# EAGLE design PICKIT4-adaptorar (EAGLE 7.7.0)
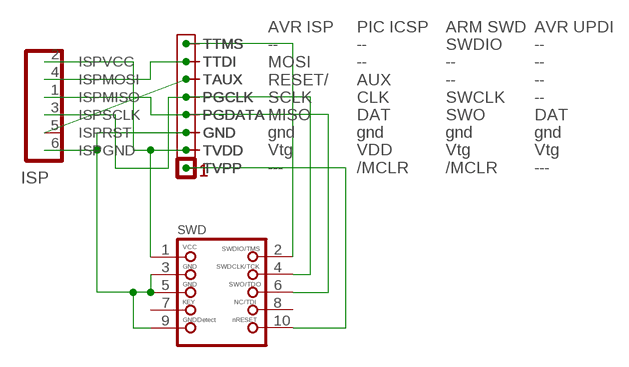
[diagram p0: schematic, sheet 1]

## Parts
ISP  AVR-ISP  [6PINS]
SWD  JTAG-CORTEXM3  [2X05_1.27MM_SMT]
U$1  PICKIT4PINHDR  [PINHEAD1X8]
U$3  PICKIT4PINHDR  [PINHEAD1X8]
U$4  PICKIT4PINHDR  [PINHEAD1X8]

## Nets
CLK [clock]: ISP.3(ISPSCLK) SWD.4 U$1.P$5(PGCLK) U$3.P$5(PGCLK) U$4.P$5(PGCLK)
DATA [clock]: ISP.1(ISPMISO) SWD.6 U$1.P$4(PGDATA) U$3.P$4(PGDATA) U$4.P$4(PGDATA)
GND [power]: ISP.6(ISPGND) SWD.3 SWD.5 SWD.9 U$1.P$3(GND) U$3.P$3(GND) U$4.P$3(GND)
TAUX: ISP.5(ISPRST) U$1.P$6(TAUX) U$3.P$6(TAUX) U$4.P$6(TAUX)
TTDI [clock]: ISP.4(ISPMOSI) U$1.P$7(TTDI) U$3.P$7(TTDI) U$4.P$7(TTDI)
TTMS: SWD.2 U$1.P$8(TTMS) U$3.P$8(TTMS) U$4.P$8(TTMS)
TVDD [power]: ISP.2(ISPVCC) SWD.1 U$1.P$2(TVDD) U$3.P$2(TVDD) U$4.P$2(TVDD)
VPP: SWD.10 U$1.P$1(TVPP) U$3.P$1(TVPP) U$4.P$1(TVPP)
Unconnected: SWD.7 SWD.8

## Library data of the parts
ISP = Arduino-shield-scaffolds:AVR-ISP: AVR SPI ISP programming connector (6pins)
SWD = microbuilder:JTAG-CORTEXM3: Serial Wire (SW-DP) Connector This standard 0.05" 10-pin connector is for use with the Cortex M0/M3's native SWD (serial wire debugger) interface (SW-DP). Some boards support a 20-pin combined JTAG+SWD connector (SWJ-DP), such as the LPC1700 family, but many smaller devices only work with SWD which typically use the smaller 10-pin SW-DP connecter (the LPC1300 family, for example, only supports SWD). 2x05 1.27mm/0.05" Connector: This is the standard SMT connector defined by ARM for all Cortex devices, and should be used in most situations and for forward-compatibility since any new devices coming to market will likely use this connector. MOLEX 10 Pin 0.1" Connector: This 0.1" 10 pin connector has the same pin layout as the standard 0.05" connector, but is easier to work with if you are using standard jumper wires or custom cables to connect your SWD hardware. MOLEX 20 Pin 0.1" Connector: This 0.1" 20 pin connector is the same model used for ARM7/ARM9 JTAG debuggers, but is connected to match the pins on the Segger J-Link for ARM (which supports both JTAG and SWD debugging). See the following document from ARM for more information on Cortex M3 Debug Connectors: http://infocenter.arm.com/help/topic/com.arm.doc.faqs/attached/13634/cortex_debug_connectors.pdf And the following page for an overview with images of the different connector types: http://www.keil.com/peripherals/coresight/connectors.asp
U$1 U$3 U$4 = mylib4:PICKIT4: PICKIT 4 Programming connector Handles PICx, ARM SWD, AVR ISP, UPDI, PDI, TPI, an JTAG/EJTAG

## Net classes
0 default: width 0.4 mm, drill 0.6 mm, clearance 0.152 mm
1 power: width 0.8 mm, drill 0.7 mm, clearance 0.152 mm
2 clock: width 0.25 mm, drill 0.6 mm, clearance 0.152 mm

## Board
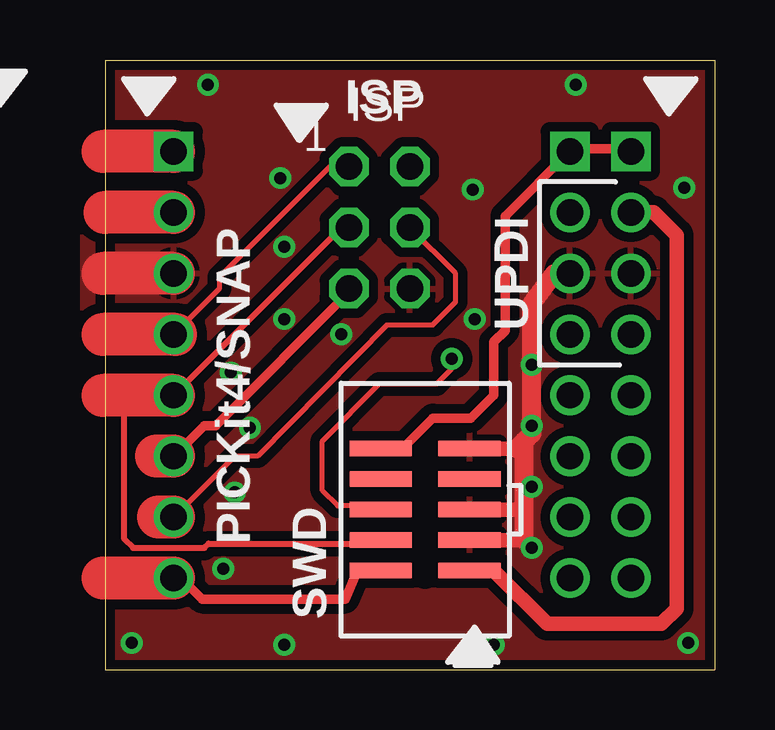
[diagram p1: board, top side]
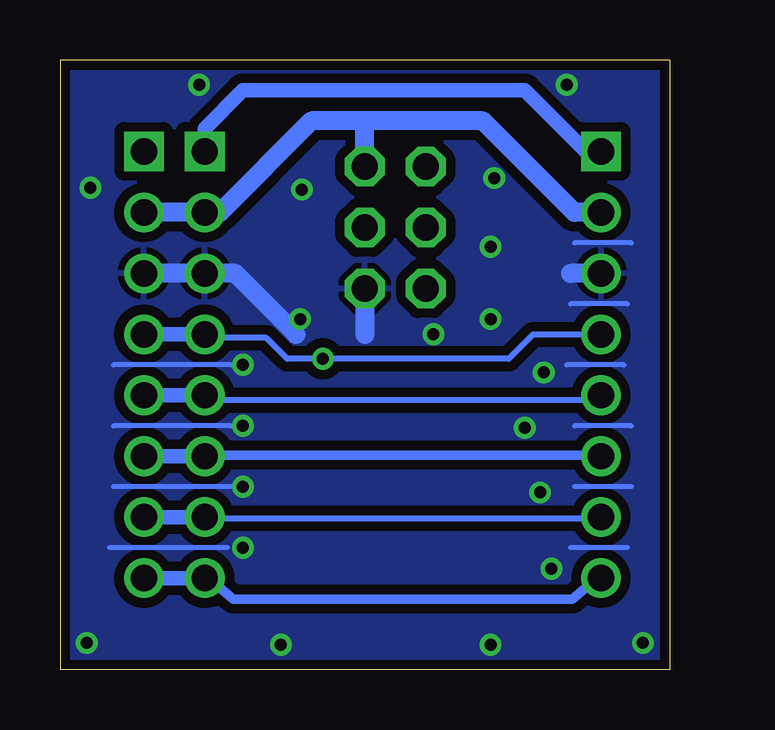
[diagram p2: board, bottom side, seen from below]

Size 25.4 x 25.4 mm. Coordinates in mm from the lower left corner, seen from the top.
Outline: 0,0 25.4,0 25.4,25.4 0,25.4 0,0
Copper layers (1*16): Top 0.035mm / dielectric 1.5mm / Bottom 0.035mm
Design rules "default *": minimum track width 10mil, minimum drill 24mil, track to track 6mil, track to pad 6mil, pad to pad 8mil, via to via 8mil, smd to smd 8mil, copper to edge 16mil, drill to drill 8mil, minimum pad ring 10mil, minimum via ring 8mil, stop-mask expansion 4mil, vias tented up to drill 0.65mm, thermal gap 10mil
tRestrict: 2 lines

### Footprints (pad centres in the part's own frame; a part is rotated, then mirrored left to right if it is on the bottom)
6PINS = drill 1.1 octagon: 1 -1.27,2.54; 2 1.27,2.54; 3 -1.27,0; 4 1.27,0; 5 -1.27,-2.54; 6 1.27,-2.54
2X05_1.27MM_SMT = smd 0.65 x 2.6: 1 -2.54,-1.85; 2 -2.54,1.85; 3 -1.27,-1.85; 4 -1.27,1.85; 5 0,-1.85; 6 0,1.85; 7 1.27,-1.85; 8 1.27,1.85; 9 2.54,-1.85; 10 2.54,1.85
PINHEAD1X8 = drill 1.1 square: P$1 0,8.89 | drill 1.1: P$2 0,6.35; P$3 0,3.81; P$4 0,1.27; P$5 0,-1.27; P$6 0,-3.81; P$7 0,-6.35; P$8 0,-8.89

### Placement (x,y rotation side)
ISP  11.43,18.41 0 top
SWD  13.34,6.67 90 top
U$1  2.86,12.7 0 top
U$3  21.91,12.7 0 top
U$4  19.37,12.7 0 top

### Tracks (layer width: path | path; a pad name or v marks a point on that pad's centre or on a via)
CLK
  Top 0.254: SWD.4 11.38,5.25 4.31,5.25 4.13,5.08 1.16,5.08 0.78,5.46 0.78,11.34 2.8,11.38 U$1.P$5 2.98,11.55 9.8,18.38 10.15,18.38 ISP.3
  Top 1.8: U$1.P$5 -0.08,11.43
  Bottom 0.254: U$4.P$5 19.25,11.22 2.98,11.22 U$1.P$5
  Bottom 0.6: U$4.P$5 U$3.P$5
DATA  (via drill 0.5)
  Top 0.2: ISP.1 9.37,20.95 4.76,16.35 4.76,15.88 2.94,14.05 U$1.P$4 | 10.32,6.83 9.68,6.83 9.05,7.46 9.05,9.53 11.43,11.91 13.81,11.91 14.45,12.54 v14.45,12.95
  Top 0.254: 10.32,6.83 11.38,6.83 SWD.6
  Top 1.5: 2.94,14.05 2.94,13.97
  Top 1.8: 2.94,13.97 -0.08,13.97
  Bottom 0.25: 6.71,12.95 5.69,13.97 U$1.P$4
  Bottom 0.254: 6.71,12.95 v14.45,12.95 15.93,12.95 16.8,13.82 19.25,13.82 U$4.P$4
  Bottom 0.6: U$4.P$4 U$3.P$4
GND  (via drill 0.5)
  Top 0.6: SWD.3 17.46,5.4 | SWD.9 17.14,9.21 | SWD.5 17.46,6.67
  Top 0.8: 17.46,5.4 17.46,6.67 17.46,9.53 | 17.46,9.53 17.78,9.84 17.78,15.24 18.73,16.51 U$4.P$3 | 17.14,9.21 17.46,9.53
  Top 1.8: U$1.P$3 -0.08,16.51
  Bottom 0.2: 1.59,7.62 3.97,7.62 | 1.59,10.16 3.97,10.16 | 1.91,12.7 4.29,12.7 | 1.75,5.08 4.13,5.08 | 1.75,15.24 4.13,15.24 | 1.59,17.78 3.97,17.78 | 18.26,7.62 23.18,7.62 | 18.26,10.16 23.18,10.16 | 18.26,12.7 23.18,12.7 | 18.41,5.08 23.34,5.08
  Bottom 0.8: U$1.P$3 4.13,16.51 | 15.56,13.97 18.1,16.51 U$4.P$3 U$3.P$3 | ISP.6 12.7,13.97
  other vias: 17.78,12.7 17.78,10.16 17.78,7.62 17.78,5.08 5.4,7.38 7.46,1.03 16.19,1.03 7.3,20.48 24.13,20.08 6.03,10.08 9.84,13.97 7.46,14.61 15.4,14.61 7.46,17.62 5.24,12.38 4.29,24.37 19.61,24.37 1.11,1.11 24.29,1.11 15.32,20 4.92,4.21
  pour Top (isolate 0.4): -0.95,26.04 -0.95,-0.95 26.67,-0.95 26.67,26.04 0.32,26.04
  pour Bottom (isolate 0.4): -0.95,25.72 -0.95,-0.64 26.67,-0.64 26.67,26.67 21.27,26.67
TAUX
  Top 0.4: ISP.5 10.16,15.72 4.6,10.16 4.13,10.16 U$1.P$6
  Top 1.8: U$1.P$6 2.14,8.89
  Bottom 0.4: U$4.P$6 19.25,8.93 2.98,8.93 U$1.P$6
  Bottom 0.6: U$4.P$6 U$3.P$6
TTDI
  Top 0.2: U$1.P$7 5.4,8.89 6.35,8.89 11.75,14.37 13.65,14.37 14.61,15.32 14.61,16.51 ISP.4
  Top 1.8: U$1.P$7 2.22,6.35
  Bottom 0.254: U$1.P$7 2.98,6.3 19.25,6.3 U$4.P$7
  Bottom 0.6: U$4.P$7 U$3.P$7
TTMS
  Top 0.4: SWD.2 11.38,4.03 10.48,4.05 10,2.94 4.05,2.94 3.15,3.83 3.15,4.03 2.98,3.85 U$1.P$8
  Top 1.8: U$1.P$8 -0.08,3.81
  Bottom 0.4: U$4.P$8 19.25,3.85 18.18,2.94 4.05,2.94 2.98,3.85 U$1.P$8
  Bottom 0.6: U$4.P$8 U$3.P$8
TVDD
  Top 0.6: SWD.1 16.19,4.13 18.41,1.91 23.18,1.91 23.81,2.54 23.81,18.1 22.86,19.05 U$3.P$2
  Top 1.8: U$1.P$2 0,19.05
  Bottom 0.8: U$1.P$2 3.97,19.05 7.78,22.86 12.7,22.86 | 12.7,22.86 14.92,22.86 18.73,19.05 U$4.P$2 U$3.P$2 | ISP.2 12.7,22.86
VPP
  Top 0.4: 19.43,21.7 U$4.P$1 | U$3.P$1 21.88,21.7 19.6,21.7 U$4.P$1 | SWD.10 12.38,9.21 13.65,10.48 15.24,10.48 16.19,11.43 16.19,13.65 16.67,14.13 16.67,18.89 U$4.P$1
  Top 1.8: U$1.P$1 -0.08,21.59
  Bottom 0.6: U$1.P$1 3.49,21.59 6.03,24.13 17.78,24.13 19.37,22.54 U$4.P$1

### Text on the board
tSilk: ISP | UPDI | PICKit4/SNAP | SWD
_bplace: Snap to Various / by WestfW | SNAP or PICKit4